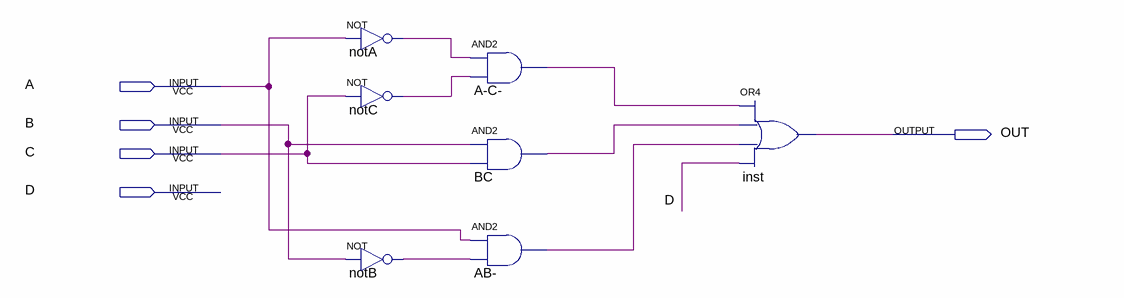
[diagram p0: schematic sheet]
// Quartus schematic c.bdf as structural Verilog: 7 symbols, 5 pins
module c (
  input  A,
  input  B,
  input  C,
  input  D,
  output OUT
);

  wire A_C__out, AB__out, BC_out, notA_out, notB_out, notC_out;

  not notA (notA_out, A);
  not notC (notC_out, C);
  not notB (notB_out, B);
  and \A-C-  (A_C__out, notA_out, notC_out);
  and BC (BC_out, B, C);
  and \AB-  (AB__out, A, notB_out);
  or inst (OUT, A_C__out, BC_out, AB__out, D);
endmodule
